# Altium schematic sheet 指纹锁.SchDoc
size A4
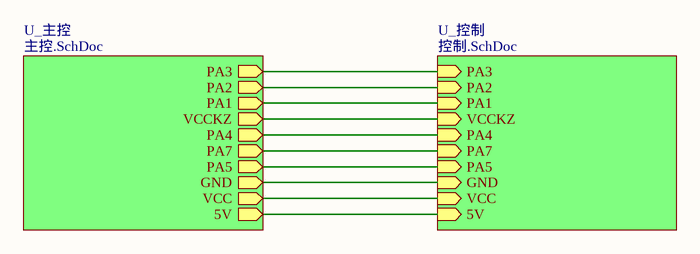
[diagram p0: 指纹锁.SchDoc]

## Sub-sheets
U_主控 = 主控.SchDoc: PA3 (out), PA2 (out), PA1 (out), VCCKZ (out), PA4 (out), PA7 (out), PA5 (out), GND (out), VCC (out), 5V (out)
U_控制 = 控制.SchDoc: PA3 (in), PA2 (in), PA1 (in), VCCKZ (in), PA4 (in), PA7 (in), PA5 (in), GND (in), VCC (in), 5V (in)

## Nets
(unnamed): sheet U_控制/PA3, sheet U_主控/PA3
(unnamed): sheet U_控制/PA2, sheet U_主控/PA2
(unnamed): sheet U_控制/PA1, sheet U_主控/PA1
(unnamed): sheet U_控制/VCCKZ, sheet U_主控/VCCKZ
(unnamed): sheet U_控制/PA4, sheet U_主控/PA4
(unnamed): sheet U_控制/PA7, sheet U_主控/PA7
(unnamed): sheet U_控制/PA5, sheet U_主控/PA5
(unnamed): sheet U_控制/GND, sheet U_主控/GND
(unnamed): sheet U_控制/VCC, sheet U_主控/VCC
(unnamed): sheet U_控制/5V, sheet U_主控/5V